# EAGLE design DualStepperController (EAGLE 7.7.0)
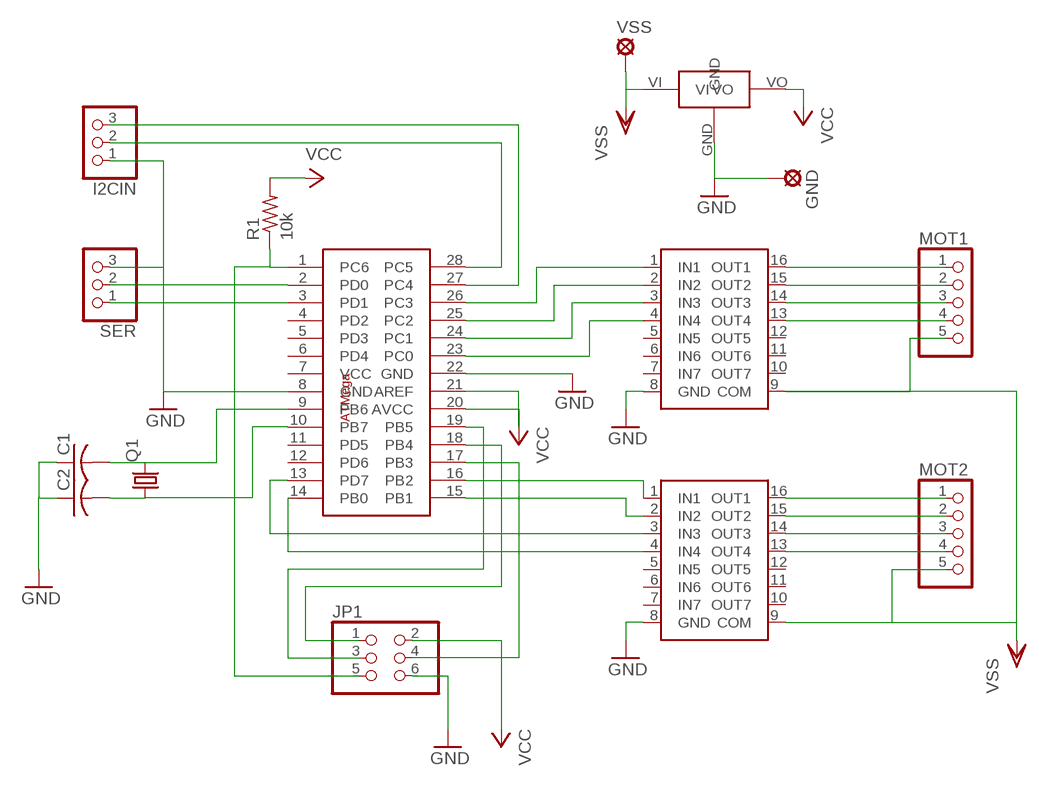
[diagram p0: schematic, sheet 1]

## Parts
C1  C-US025-024X044  [C025-024X044]
C2  C-US025-024X044  [C025-024X044]
GND  SE14  [SE14]
I2CIN  PINHD-1X3  [1X03]
JP1  PINHD-2X3  [2X03]
MOT1  PINHD-1X5  [1X05]
MOT2  PINHD-1X5  [1X05]
Q1  CRYSTALHC49S  [HC49/S]
R1  10k  R-US_0207/7  [0207/7]
SER  PINHD-1X3  [1X03]
U$1  ATMEGA328P  [ATMEGA328P-DIP]
U$2  ULN2003  [DIP16]
U$3  ULN2003  [DIP16]
U$4  7805-TO220V  [TO220AV]
VSS  SE14  [SE14]

## Nets
GND: C1.1 C2.1 GND.MP I2CIN.1 JP1.6 SER.3 U$1.8(GND) U$1.22(GND) U$2.8(GND) U$3.8(GND) U$4.GND
N$1: MOT1.1 U$2.16(OUT1)
N$2: MOT1.2 U$2.15(OUT2)
N$3: MOT1.3 U$2.14(OUT3)
N$4: MOT1.4 U$2.13(OUT4)
N$5: I2CIN.2 U$1.28(PC5)
N$6: I2CIN.3 U$1.27(PC4)
N$7: MOT2.1 U$3.16(OUT1)
N$8: MOT2.2 U$3.15(OUT2)
N$9: MOT2.3 U$3.14(OUT3)
N$10: MOT2.4 U$3.13(OUT4)
N$11: C1.2 Q1.2 U$1.9(PB6)
N$12: C2.2 Q1.1 U$1.10(PB7)
N$13: SER.1 U$1.3(PD1)
N$14: JP1.5 R1.1 U$1.1(PC6)
N$15: JP1.1 U$1.18(PB4)
N$16: JP1.3 U$1.19(PB5)
N$17: JP1.4 U$1.17(PB3)
N$18: U$1.26(PC3) U$2.1(IN1)
N$19: U$1.25(PC2) U$2.2(IN2)
N$20: U$1.24(PC1) U$2.3(IN3)
N$21: U$1.23(PC0) U$2.4(IN4)
N$22: U$1.16(PB2) U$3.1(IN1)
N$23: U$1.15(PB1) U$3.2(IN2)
N$24: U$1.14(PB0) U$3.4(IN4)
N$25: U$1.13(PD7) U$3.3(IN3)
N$26: SER.2 U$1.2(PD0)
VCC: JP1.2 R1.2 U$1.20(AVCC) U$1.21(AREF) U$4.VO
VSS: MOT1.5 MOT2.5 U$2.9(COM) U$3.9(COM) U$4.VI VSS.MP
Unconnected: U$1.4(PD2) U$1.5(PD3) U$1.6(PD4) U$1.7(VCC) U$1.11(PD5) U$1.12(PD6) U$2.5(IN5) U$2.6(IN6) U$2.7(IN7) U$2.10(OUT7) U$2.11(OUT6) U$2.12(OUT5) U$3.5(IN5) U$3.6(IN6) U$3.7(IN7) U$3.10(OUT7) U$3.11(OUT6) U$3.12(OUT5)

## Library data of the parts
C1 C2 = rcl:C-US: CAPACITOR, American symbol
GND VSS = solpad:SE14: SOLDER PAD E1553, drill 1,4mm, distributor Buerklin, 07F820
I2CIN SER = pinhead:PINHD-1X3: PIN HEADER
JP1 = pinhead:PINHD-2X3: PIN HEADER
MOT1 MOT2 = pinhead:PINHD-1X5: PIN HEADER
Q1 = crystal:CRYSTAL: CRYSTAL; OC_FARNELL: 1667008; OC_NEWARK: unknown
R1 = rcl:R-US_: RESISTOR, American symbol
U$1 = ATMega328p:ATMEGA328P
U$2 U$3 = ULN2003:ULN2003
U$4 = LM7805:7805-TO220V

## Board
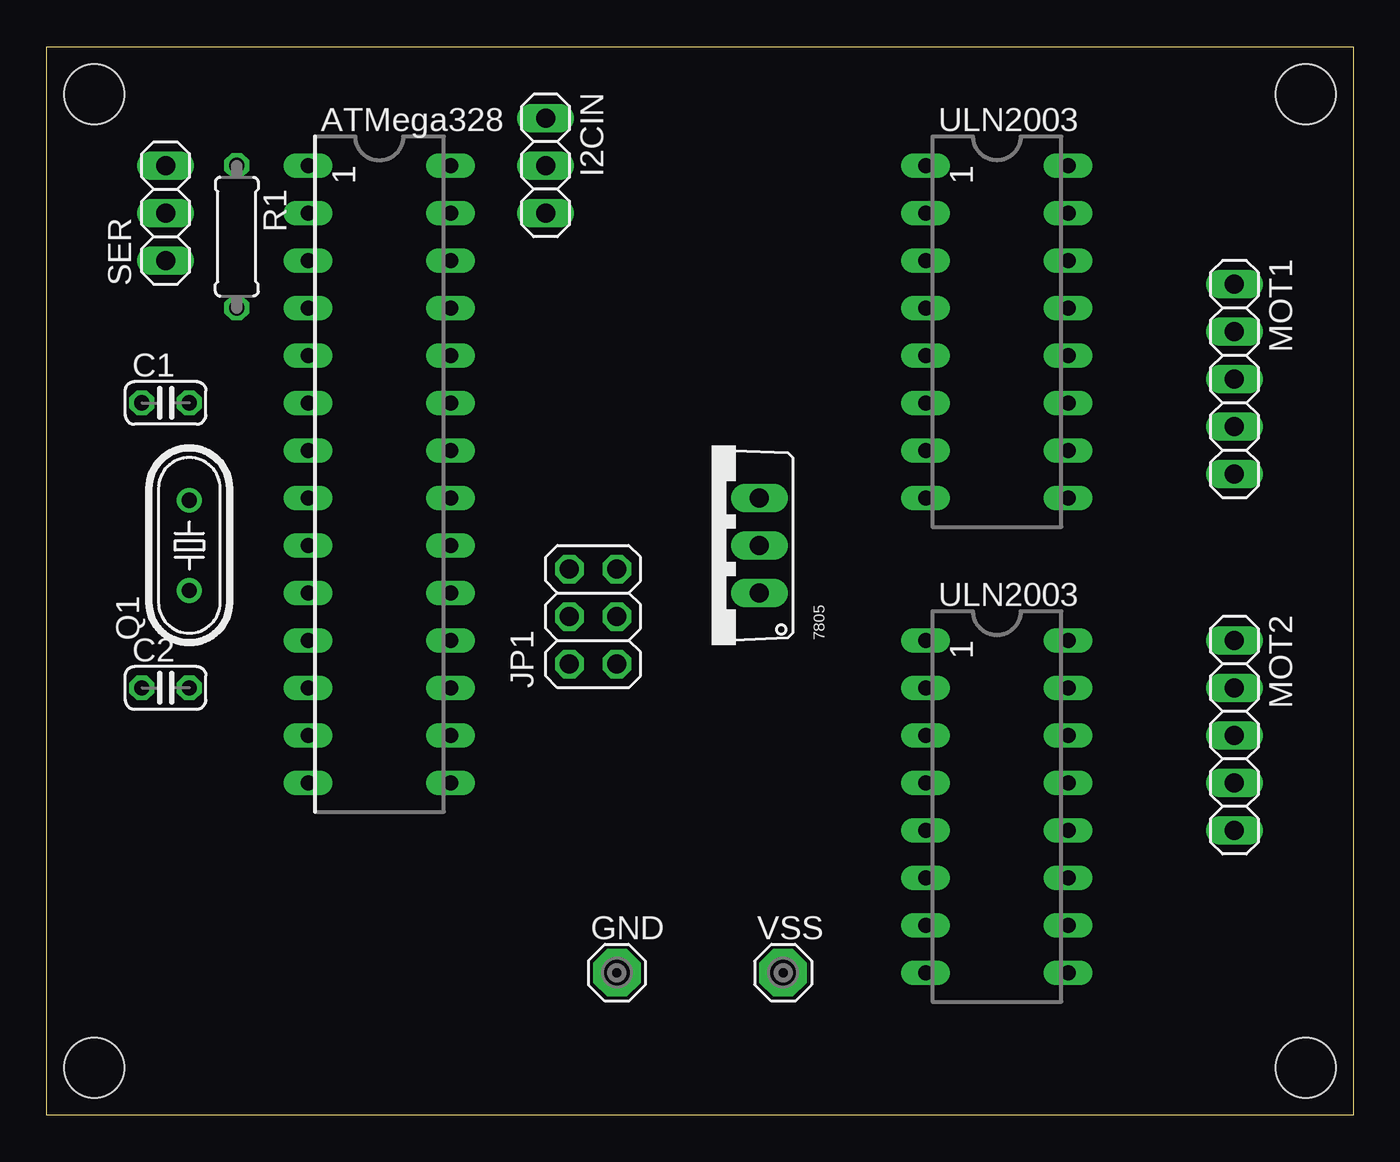
[diagram p1: board, top side]
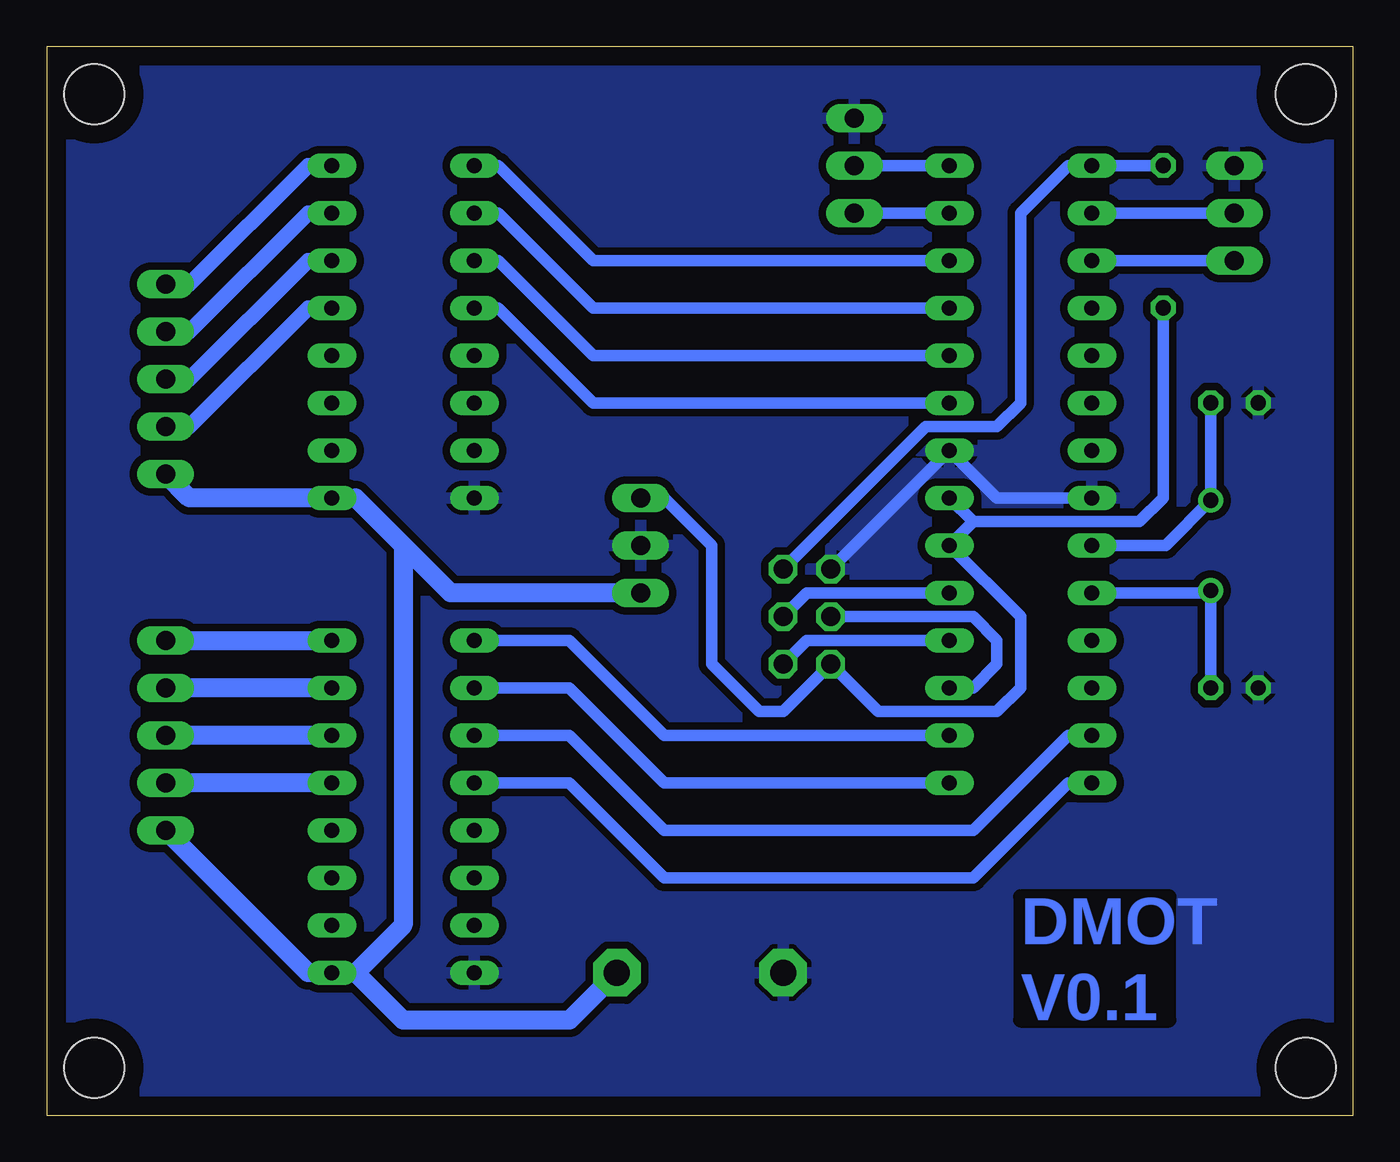
[diagram p2: board, bottom side, seen from below]

Size 69.85 x 57.15 mm. Coordinates in mm from the lower left corner, seen from the top.
Outline: 0,57.15 69.85,57.15 69.85,0 0,0 0,57.15
Copper layers (1*16): Top 0.035mm / dielectric 1.5mm / Bottom 0.035mm
Design rules "default": minimum track width 10mil, minimum drill 24mil, track to track 8mil, track to pad 8mil, pad to pad 8mil, via to via 8mil, smd to smd 8mil, copper to edge 40mil, drill to drill 8mil, minimum pad ring 10mil, minimum via ring 8mil, stop-mask expansion 4mil, vias tented up to drill 0mil, thermal gap 10mil
Holes 3.2 mm at 2.54,54.61 67.31,54.61 67.31,2.54 2.54,2.54

### Footprints (pad centres in the part's own frame; a part is rotated, then mirrored left to right if it is on the bottom)
C025-024X044 = drill 0.813 octagon: 1 -1.27,0; 2 1.27,0
SE14 = drill 1.397 pad 2.54 octagon: MP 0,0
1X03 = drill 1.016 long: 1 -2.54,0; 2 0,0; 3 2.54,0
2X03 = drill 1.016 octagon: 1 -2.54,-1.27; 2 -2.54,1.27; 3 0,-1.27; 4 0,1.27; 5 2.54,-1.27; 6 2.54,1.27
1X05 = drill 1.016 long: 1 -5.08,0; 2 -2.54,0; 3 0,0; 4 2.54,0; 5 5.08,0
HC49/S = drill 0.813: 1 -2.413,0; 2 2.413,0
0207/7 = drill 0.813 octagon: 1 -3.81,0; 2 3.81,0
ATMEGA328P-DIP = drill 0.8 long: 1 -16.51,-3.81; 2 -13.97,-3.81; 3 -11.43,-3.81; 4 -8.89,-3.81; 5 -6.35,-3.81; 6 -3.81,-3.81; 7 -1.27,-3.81; 8 1.27,-3.81; 9 3.81,-3.81; 10 6.35,-3.81; 11 8.89,-3.81; 12 11.43,-3.81; 13 13.97,-3.81; 14 16.51,-3.81; 15 16.51,3.81; 16 13.97,3.81; 17 11.43,3.81; 18 8.89,3.81; 19 6.35,3.81; 20 3.81,3.81; 21 1.27,3.81; 22 -1.27,3.81; 23 -3.81,3.81; 24 -6.35,3.81; 25 -8.89,3.81; 26 -11.43,3.81; 27 -13.97,3.81; 28 -16.51,3.81
DIP16 = drill 0.8 long: 1 -8.89,-3.81; 2 -6.35,-3.81; 3 -3.81,-3.81; 4 -1.27,-3.81; 5 1.27,-3.81; 6 3.81,-3.81; 7 6.35,-3.81; 8 8.89,-3.81; 9 8.89,3.81; 10 6.35,3.81; 11 3.81,3.81; 12 1.27,3.81; 13 -1.27,3.81; 14 -3.81,3.81; 15 -6.35,3.81; 16 -8.89,3.81
TO220AV = drill 1.016 long: GND 0,-2.54; VI -2.54,-2.54; VO 2.54,-2.54

### Placement (x,y rotation side)
C1  6.35,38.1 0 top
C2  6.35,22.86 0 top
GND  30.48,7.62 0 top
I2CIN  26.67,50.8 270 top
JP1  29.21,26.67 90 top
MOT1  63.5,39.37 270 top
MOT2  63.5,20.32 270 top
Q1  7.62,30.48 90 top
R1  10.16,46.99 270 top
SER  6.35,48.26 90 top
U$1  17.78,34.29 270 top
U$2  50.8,41.91 270 top
U$3  50.8,16.51 270 top
U$4  35.56,30.48 90 top
VSS  39.37,7.62 0 top

### Tracks (layer width: path | path; a pad name or v marks a point on that pad's centre or on a via)
GND
  Bottom 0.61: JP1.6 U$1.22 19.05,33.02 U$1.8
  pour Bottom (isolate 0.406): 0,57.15 69.85,57.15 69.85,0 0,0
N$1
  Bottom 0.813: U$2.16 55.88,50.8 62.23,44.45 MOT1.1
N$2
  Bottom 0.813: U$2.15 55.88,48.26 62.23,41.91 MOT1.2
N$3
  Bottom 0.813: U$2.14 55.88,45.72 62.23,39.37 MOT1.3
N$4
  Bottom 0.813: U$2.13 55.88,43.18 62.23,36.83 MOT1.4
N$5
  Bottom 0.61: U$1.28 I2CIN.2
N$6
  Bottom 0.61: U$1.27 I2CIN.3
N$7
  Bottom 1.016: MOT2.1 U$3.16
N$8
  Bottom 1.016: U$3.15 MOT2.2
N$9
  Bottom 1.016: U$3.14 MOT2.3
N$10
  Bottom 1.016: U$3.13 MOT2.4
N$11
  Bottom 0.61: U$1.9 10.03,30.48 Q1.2 C1.2
N$12
  Bottom 0.61: U$1.10 7.75,27.94 Q1.1 C2.2
N$13
  Bottom 0.61: U$1.3 SER.1
N$14
  Bottom 0.61: U$1.1 R1.1 15.24,50.8 17.78,48.26 17.78,38.1 19.05,36.83 22.86,36.83 JP1.5
N$15
  Bottom 0.61: U$1.18 29.21,25.4 JP1.1
N$16
  Bottom 0.61: U$1.19 29.21,27.94 JP1.3
N$17
  Bottom 0.61: JP1.4 20.32,26.67 19.05,25.4 19.05,24.13 20.32,22.86 U$1.17
N$18
  Bottom 0.61: U$2.1 45.72,50.8 40.64,45.72 U$1.26
N$19
  Bottom 0.61: U$1.25 40.64,43.18 45.72,48.26 U$2.2
N$20
  Bottom 0.61: U$1.24 40.64,40.64 45.72,45.72 U$2.3
N$21
  Bottom 0.61: U$1.23 40.64,38.1 45.72,43.18 U$2.4
N$22
  Bottom 0.61: U$1.16 36.83,20.32 41.91,25.4 U$3.1
N$23
  Bottom 0.61: U$1.15 36.83,17.78 41.91,22.86 U$3.2
N$24
  Bottom 0.61: U$1.14 15.24,17.78 20.32,12.7 36.83,12.7 41.91,17.78 U$3.4
N$25
  Bottom 0.61: U$1.13 15.24,20.32 20.32,15.24 36.83,15.24 41.91,20.32 U$3.3
N$26
  Bottom 0.61: SER.2 U$1.2
VCC
  Bottom 0.61: U$4.VO 36.83,33.02 34.29,30.48 34.29,24.13 31.75,21.59 30.48,21.59 JP1.2 25.4,21.59 19.05,21.59 17.78,22.86 17.78,26.67 U$1.20 20.32,31.75 | 20.32,31.75 11.43,31.75 10.16,33.02 R1.2 | 20.32,31.75 U$1.21
VSS
  Bottom 0.813: U$2.9 53.34,33.02 | 53.34,7.62 U$3.9
  Bottom 1.016: 53.34,33.02 50.8,30.48 | 50.8,30.48 50.8,10.16 53.34,7.62 50.8,5.08 41.91,5.08 VSS.MP | U$4.VI 48.26,27.94 50.8,30.48 | U$2.9 62.23,33.02 MOT1.5 | U$3.9 55.88,7.62 MOT2.5

### Text on the board
Bottom: DMOT / V0.1